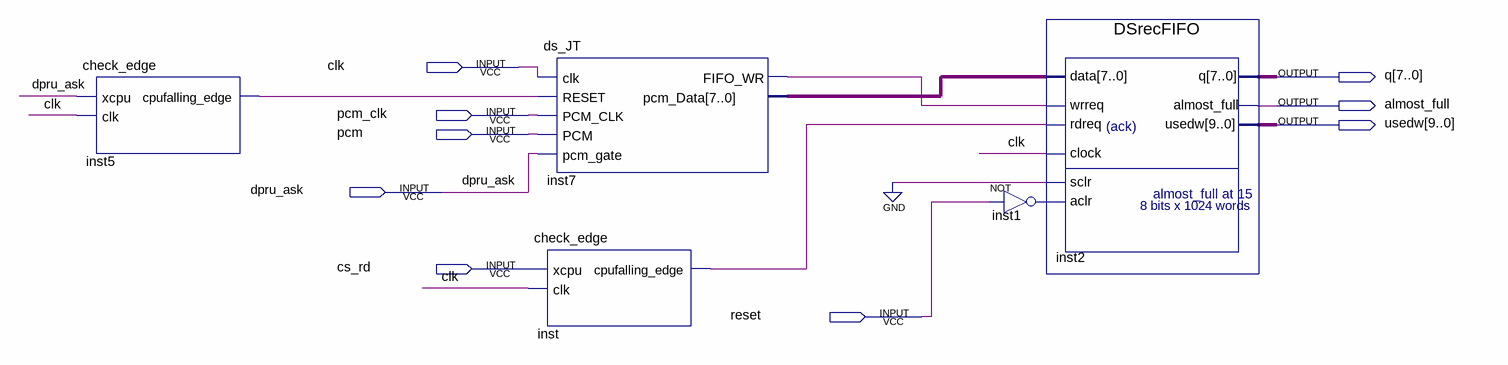
[diagram p0: schematic sheet]
// Quartus schematic ds_interface.bdf as structural Verilog: 5 symbols, 9 pins
module ds_interface (
  input  clk,
  input  pcm_clk,
  input  pcm,
  input  dpru_ask,
  input  cs_rd,
  input  reset,
  output [7:0] q,
  output almost_full,
  output [9:0] usedw
);

  wire inst1_out, inst5_cpufalling_edge, inst7_fifo_wr, inst_cpufalling_edge;
  wire [7:0] inst7_pcm_data;

  check_edge inst5 (.xcpu(dpru_ask), .clk(clk), .cpufalling_edge(inst5_cpufalling_edge));
  check_edge inst (.xcpu(cs_rd), .clk(clk), .cpufalling_edge(inst_cpufalling_edge));
  ds_JT inst7 (
    .clk(clk), .RESET(inst5_cpufalling_edge), .PCM_CLK(pcm_clk), .PCM(pcm), .pcm_gate(dpru_ask),
    .FIFO_WR(inst7_fifo_wr), .pcm_Data(inst7_pcm_data));
  not inst1 (inst1_out, reset);
  DSrecFIFO inst2 (
    .data(inst7_pcm_data), .wrreq(inst7_fifo_wr), .rdreq(inst_cpufalling_edge), .clock(clk), .sclr(1'b0),
    .aclr(inst1_out), .q(q), .almost_full(almost_full), .usedw(usedw));
endmodule
